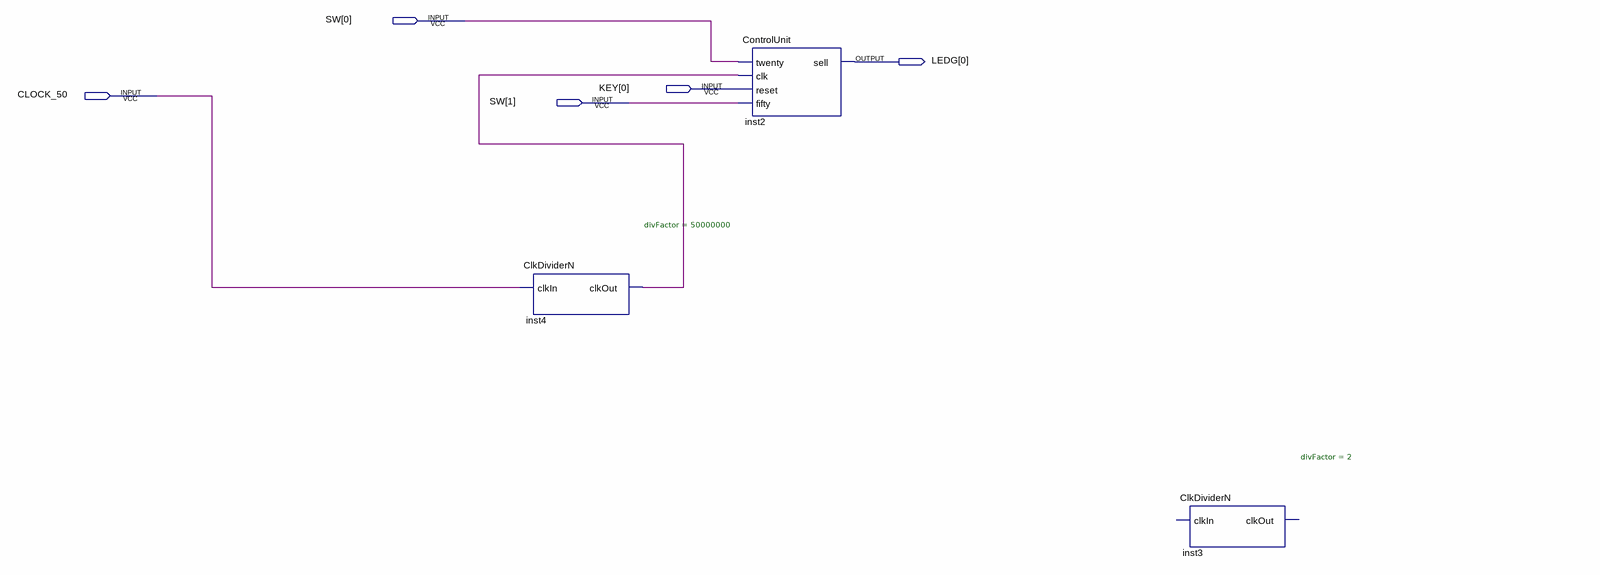
[diagram p0: schematic sheet]
// Quartus schematic DrinksMachine.bdf as structural Verilog: 3 symbols, 5 pins
module DrinksMachine (
  input  [1:0] SW,
  input  [0:0] KEY,
  input  CLOCK_50,
  output [0:0] LEDG
);

  wire inst4_clkout;

  ClkDividerN #(.divFactor(50000000)) inst4 (.clkIn(CLOCK_50), .clkOut(inst4_clkout));
  ControlUnit inst2 (.twenty(SW[0]), .clk(inst4_clkout), .reset(KEY[0]), .fifty(SW[1]), .sell(LEDG[0]));
  ClkDividerN #(.divFactor(2)) inst3 ();  // open: clkIn, clkOut
endmodule
